# EAGLE schematic System (EAGLE 9.6.2)
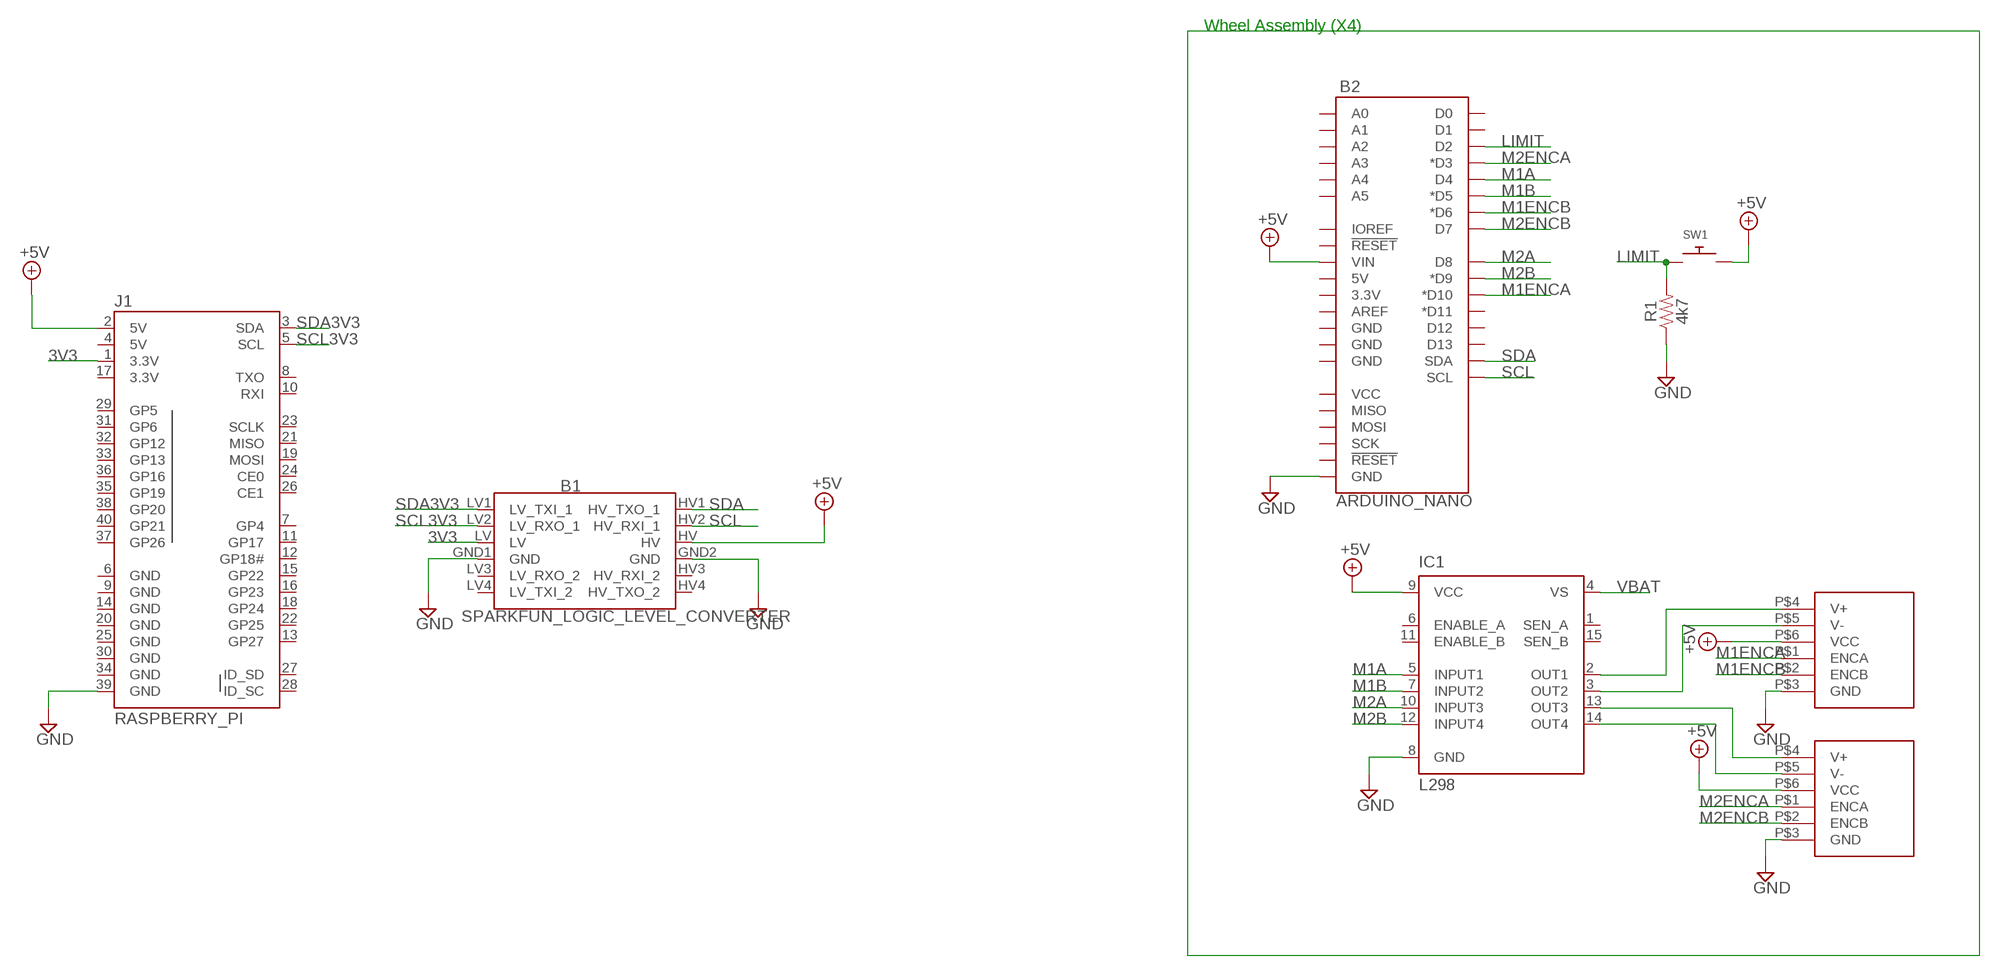
[diagram p0: schematic, sheet 1]

## Parts
B1  SPARKFUN_LOGIC_LEVEL_CONVERTER  [SPARKFUN_LOGIC_LEVEL_CONVERTER]
B2  ARDUINO_NANO  ARDUINO_UNO_R3  [ARDUINO_R3]
IC1  L298  [MULTIWATT-15]
J1  RASPBERRY_PI  RASPBERRYPI-40-PIN-GPIO_PTH_NO_SHROUD  [2X20]
MOTOR  MOTOR  [MOTOR]
R1  4k7  20OHM-0603-1/10W-1%  [0603]
SW1  SWITCH_PUSHBUTTONEVQ-PE  [TACT_PANA-EVQ]
U$2  MOTOR  [MOTOR]

## Nets
3V3: B1.LV J1.1(3.3V)
+5V: B1.HV B2.VIN IC1.9(VCC) J1.2(5V) MOTOR.P$6(VCC) SW1.P$2 U$2.P$6(VCC)
GND: B1.GND1(GND) B1.GND2(GND) B2.GND@1(GND) IC1.8(GND) J1.39(GND) MOTOR.P$3(GND) R1.1 U$2.P$3(GND)
LIMIT: B2.D2 R1.2 SW1.P$1
M1A: B2.D4 IC1.5(INPUT1)
M1B: B2.D5(*D5) IC1.7(INPUT2)
M1ENCA: B2.D10(*D10) MOTOR.P$1(ENCA)
M1ENCB: B2.D6(*D6) MOTOR.P$2(ENCB)
M2A: B2.D8 IC1.10(INPUT3)
M2B: B2.D9(*D9) IC1.12(INPUT4)
M2ENCA: B2.D3(*D3) U$2.P$1(ENCA)
M2ENCB: B2.D7 U$2.P$2(ENCB)
N$1: IC1.2(OUT1) MOTOR.P$4(V+)
N$2: IC1.3(OUT2) MOTOR.P$5(V-)
N$4: IC1.13(OUT3) U$2.P$4(V+)
N$5: IC1.14(OUT4) U$2.P$5(V-)
SCL: B1.HV2(HV_RXI_1) B2.SCL
SCL3V3: B1.LV2(LV_RXO_1) J1.5(SCL)
SDA: B1.HV1(HV_TXO_1) B2.SDA
SDA3V3: B1.LV1(LV_TXI_1) J1.3(SDA)
VBAT: IC1.4(VS)
Unconnected: B1.HV3(HV_RXI_2) B1.HV4(HV_TXO_2) B1.LV3(LV_RXO_2) B1.LV4(LV_TXI_2) B2.3.3V B2.5V B2.A0 B2.A1 B2.A2 B2.A3 B2.A4 B2.A5 B2.AREF B2.D0 B2.D1 B2.D11(*D11) B2.D12 B2.D13 B2.GND@2(GND) B2.GND@3(GND) B2.GND@4(GND) B2.IOREF B2.MISO B2.MOSI B2.RESET@1(!RESET!) B2.RESET@2(!RESET!) B2.SCK B2.VCC IC1.1(SEN_A) IC1.6(ENABLE_A) IC1.11(ENABLE_B) IC1.15(SEN_B) J1.7(GP4) J1.8(TXO) J1.10(RXI) J1.11(GP17) J1.12(GP18#) J1.13(GP27) J1.15(GP22) J1.16(GP23) J1.18(GP24) J1.19(MOSI) J1.21(MISO) J1.22(GP25) J1.23(SCLK) J1.24(CE0) J1.26(CE1) J1.27(ID_SD) J1.28(ID_SC) J1.29(GP5) J1.31(GP6) J1.32(GP12) J1.33(GP13) J1.35(GP19) J1.36(GP16) J1.37(GP26) J1.38(GP20) J1.40(GP21)

## Notes on the sheet
- Wheel Assembly (X4)

## Power pins joined to a net without a drawn wire
3.3V: J1.17(3.3V)
5V: J1.4(5V)
GND: J1.6(GND) J1.9(GND) J1.14(GND) J1.20(GND) J1.25(GND) J1.30(GND) J1.34(GND)

## Library data of the parts
B1 = SparkFun-Boards:SPARKFUN_LOGIC_LEVEL_CONVERTER: SparkFun Logic Level Converter -Bi-Directional This is the mechnical outline for the 3.3V - 5V bi directional logic level converter. *Note, the "LOCK" Package has the header pins staggered by an offset of 5 mils (off center line), so that when you slide a row of standard 0.1" headers into the PTH pads, it will hold position vertically. See the follwing turorial for more information on this type of special footprints: Sneaky Footprints <https://www.sparkfun.com/tutorials/114> SparkFun Products: SparkFun Logic Level Converter - Bi-Directional <https://www.sparkfun.com/products/12009>
B2 = SparkFun-Boards:ARDUINO_UNO_R3: Arduino R3 Footprint with SPI header Arduino Uno R3 Compatible Footprint. Matches PCB size of the original board. SparkFun Products: SAMD21 Dev Breakout <https://www.sparkfun.com/products/13672> RedBoard <https://www.sparkfun.com/products/12757> R3 Stackable Headers <https://www.sparkfun.com/products/11417>
IC1 = st-microelectronics:L298: DUAL FULL-BRIDGE DRIVER; MPN: L298N; OC_FARNELL: 1589425; OC_NEWARK: 32M1527
J1 = SparkFun-Connectors:RASPBERRYPI-40-PIN-GPIO: Raspberry Pi GPIO Header 2x20 pin connector, as found on B, B+, A+ models. Both shrouded PTH and SMT versions available. SparkFun Products: GPIO Shrouded Header <https://www.sparkfun.com/products/13054>- PTH SparkFun Pi Wedge (Preassembled) <https://www.sparkfun.com/products/13717>
MOTOR U$2 = Motor:MOTOR
R1 = SparkFun-Resistors:20OHM: RES-07862; PROD_ID: RES-07862; VALUE: 20
SW1 = adafruit:SWITCH_PUSHBUTTON: Buttons SOFTTOUCHSMD_SJ - Soft touch temporary push button (Super Junk Akihabara) Compatible with SKPMANE010 [Mouser: 688-SKPMAN] C&K_KSS = Digikey: KSS221GLFS

## Module TEST
Ports: 

### Library data of the parts